# EAGLE schematic cc2650_rev1-2 (EAGLE 8.3.2)

## Sheet 1 of 2
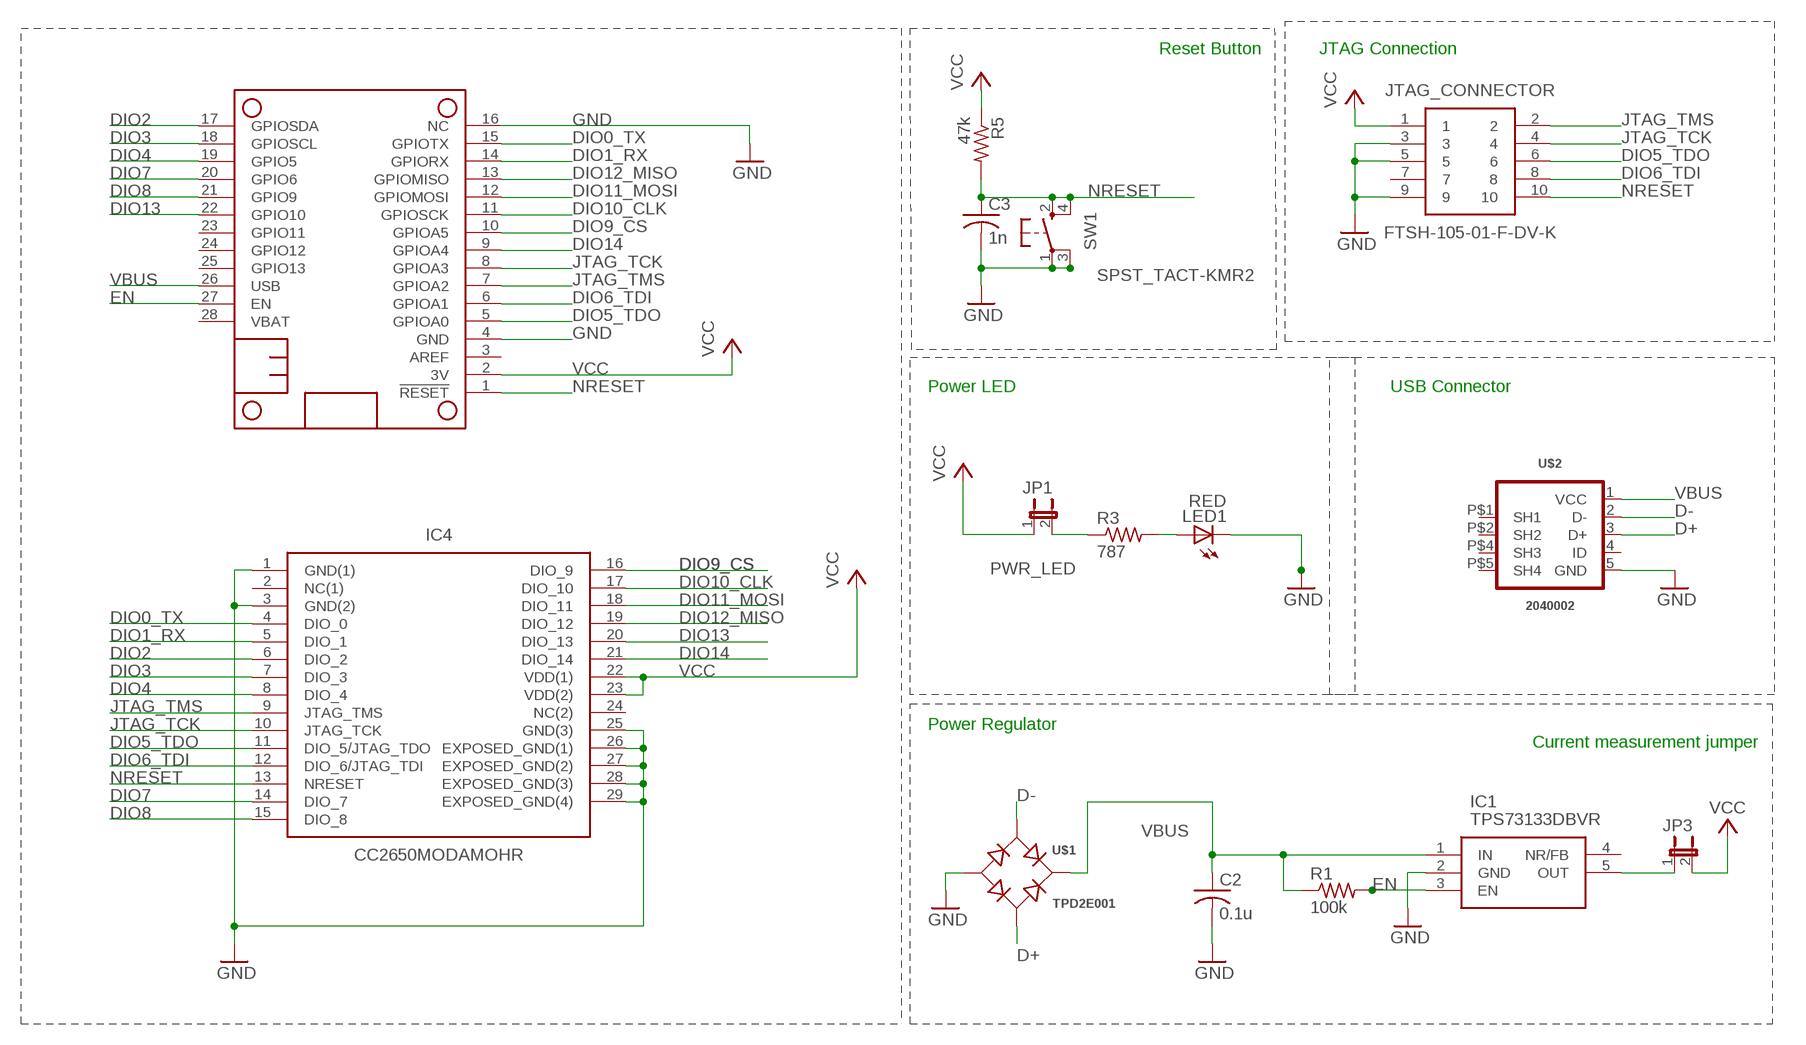
[diagram p0: schematic, sheet 1]

### Parts
C2  0.1u  C-USC1206  [C1206]
C3  1n  C-USC1206  [C1206]
IC1  TPS73133DBVR  [SOT95P280X145-5N]
IC4  CC2650MODAMOHR  [MOH0029A]
JP1  PWR_LED  JP1M  [JP1M]
JP3  PWR_LED  JP1M  [JP1M]
JTAG_CONNECTOR  FTSH-105-01-F-DV-K  [SAMTEC_FTSH-105-01-L-DV]
LED1  RED  LEDCHIPLED_1206  [CHIPLED_1206]
MS1  FEATHERWING_NODIM  [FEATHERWING_DIM]
R1  100k  R-US_R1206  [R1206]
R3  787  R-US_R1206  [R1206]
R5  47k  R-US_R1206  [R1206]
SW1  SPST_TACT-KMR2  [KMR2]
U$1  TPD2E001  [SOT-143]
U$2  2040002  [2040002]

### Nets
D+: U$1.3(AC2) U$2.3(D+)
D-: U$1.2(AC1) U$2.2(D-)
DIO0_TX: IC4.4(DIO_0) MS1.15(GPIOTX)
DIO1_RX: IC4.5(DIO_1) MS1.14(GPIORX)
DIO2: IC4.6(DIO_2) MS1.17(GPIOSDA)
DIO3: IC4.7(DIO_3) MS1.18(GPIOSCL)
DIO4: IC4.8(DIO_4) MS1.19(GPIO5)
DIO5_TDO: IC4.11(DIO_5/JTAG_TDO) JTAG_CONNECTOR.6 MS1.5(GPIOA0)
DIO6_TDI: IC4.12(DIO_6/JTAG_TDI) JTAG_CONNECTOR.8 MS1.6(GPIOA1)
DIO7: IC4.14(DIO_7) MS1.20(GPIO6)
DIO8: IC4.15(DIO_8) MS1.21(GPIO9)
DIO9_CS: IC4.16(DIO_9) MS1.10(GPIOA5)
DIO10_CLK: IC4.17(DIO_10) MS1.11(GPIOSCK)
DIO11_MOSI: IC4.18(DIO_11) MS1.12(GPIOMOSI)
DIO12_MISO: IC4.19(DIO_12) MS1.13(GPIOMISO)
DIO13: IC4.20(DIO_13) MS1.22(GPIO10) ; also sheet 2
DIO14: IC4.21(DIO_14) MS1.9(GPIOA4) ; also sheet 2
EN: IC1.3(EN) MS1.27(EN) R1.2
GND: C2.2 C3.2 IC1.2(GND) IC4.1(GND(1)) IC4.3(GND(2)) IC4.25(GND(3)) IC4.26(EXPOSED_GND(1)) IC4.27(EXPOSED_GND(2)) IC4.28(EXPOSED_GND(3)) IC4.29(EXPOSED_GND(4)) JTAG_CONNECTOR.3 JTAG_CONNECTOR.5 JTAG_CONNECTOR.9 LED1.C MS1.4(GND) MS1.16(NC) SW1.1(P) SW1.3(P1) U$1.1(-) U$2.5(GND) ; also sheet 2
JTAG_TCK: IC4.10(JTAG_TCK) JTAG_CONNECTOR.4 MS1.8(GPIOA3)
JTAG_TMS: IC4.9(JTAG_TMS) JTAG_CONNECTOR.2 MS1.7(GPIOA2)
NRESET: C3.1 IC4.13(NRESET) JTAG_CONNECTOR.10 MS1.1(!RESET) R5.2 SW1.2(S) SW1.4(S1)
PWR_LED: LED1.A R3.2
PWR_LED_JPR: JP1.2 R3.1
VBUS [Power]: C2.1 IC1.1(IN) MS1.26(USB) R1.1 U$1.4(+) U$2.1(VCC)
VCC: IC4.22(VDD(1)) IC4.23(VDD(2)) JP1.1 JP3.2 JTAG_CONNECTOR.1 MS1.2(3V) R5.1
VCC_JPR: IC1.5(OUT) JP3.1
Unconnected: IC1.4(NR/FB) IC4.2(NC(1)) IC4.24(NC(2)) JTAG_CONNECTOR.7 MS1.3(AREF) MS1.23(GPIO11) MS1.24(GPIO12) MS1.25(GPIO13) MS1.28(VBAT) U$2.4(ID) U$2.P$1(SH1) U$2.P$2(SH2) U$2.P$4(SH3) U$2.P$5(SH4)

### Notes on the sheet
- Reset Button | JTAG Connection
- Power LED | USB Connector
- Power Regulator
- Current measurement jumper

## Sheet 2 of 2
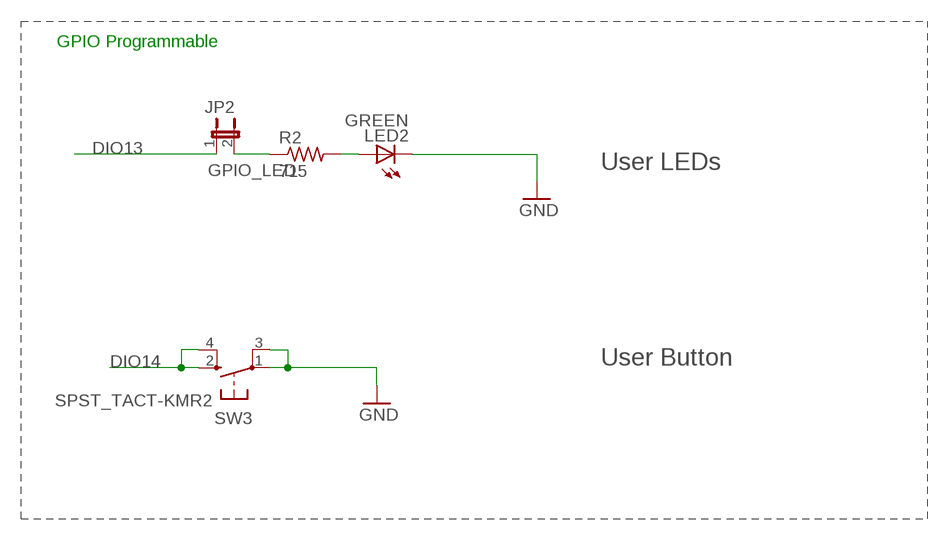
[diagram p1: schematic, sheet 2]

### Parts
JP2  GPIO_LED  JP1M  [JP1M]
LED2  GREEN  LEDCHIPLED_1206  [CHIPLED_1206]
R2  715  R-US_R1206  [R1206]
SW3  SPST_TACT-KMR2  [KMR2]

### Nets
DIO13: JP2.1 ; also sheet 1
DIO14: SW3.2(S) SW3.4(S1) ; also sheet 1
GND: LED2.C SW3.1(P) SW3.3(P1) ; also sheet 1
GPIO_LED: LED2.A R2.2
GPIO_LED_JPR: JP2.2 R2.1

### Notes on the sheet
- GPIO Programmable
- User LEDs
- User Button

## Library data of the parts
C2 C3 = adafruit:C-US: CAPACITOR, American symbol; MF: VISHAY/VITRAMON; MPN: VJ1206Y102KXBAC; OC_NEWARK: 48C2970
IC1 = TPS73133DBVR:TPS73133DBVR: Texas Instruments TPS73133DBVR, LDO Voltage Regulator, 0.15A, 3.3 V 0.5%, 1.7 5.5 Vin, 5-Pin SOT-23 Source: Datasheet <http://www.ti.com/lit/gpn/tps731>; DESCRIPTION: Texas Instruments TPS73133DBVR, LDO Voltage Regulator, 0.15A, 3.3 V 0.5%, 1.7 5.5 Vin, 5-Pin SOT-23; HEIGHT: 1.45mm; MANUFACTURER_NAME: Texas Instruments; MANUFACTURER_PART_NUMBER: TPS73133DBVR; MPN: TPS73133DBVR; OC_NEWARK: 86W6350; RS_PART_NUMBER: 6613970; SUPPLIER_NAME: RS
IC4 = CC2650MODAMOHR(2):CC2650MODAMOHR: SimpleLink Bluetooth low energy Wireless MCU Module <https://componentsearchengine.com/Images/9/CC2650MODAMOHR.jpg> Source: Datasheet <http://www.ti.com/lit/gpn/cc2650moda>; DESCRIPTION: SimpleLink Bluetooth low energy Wireless MCU Module; HEIGHT: mm; MANUFACTURER_NAME: Texas Instruments; MANUFACTURER_PART_NUMBER: CC2650MODAMOHR; MPN: CC2650MODAMOHR; OC_NEWARK: 02AC9626; SUPPLIER_NAME: RS
JP1-JP3 = jumper:JP1M; MPN: 2211S-02G; OC_NEWARK: 08N6744
JTAG_CONNECTOR = FTSH-105-01-F-DV-K:FTSH-105-01-F-DV-K: .050 x .050 CL DOUBLE VERTICAL SMT TERMINAL STRIP <https://componentsearchengine.com/Images/9/FTSH-105-01-F-DV-K.jpg> Source: Datasheet <http://suddendocs.samtec.com/prints/ftsh-1xx-xx-xxx-dv-xxx-xxx-mkt.pdf>; DESCRIPTION: .050 x .050 CL DOUBLE VERTICAL SMT TERMINAL STRIP; HEIGHT: mm; MANUFACTURER_NAME: SAMTEC; MANUFACTURER_PART_NUMBER: FTSH-105-01-F-DV-K; MPN: FTSH-105-01-F-DV-K; OC_NEWARK: 45P5160; SUPPLIER_NAME: RS
LED1 LED2 = adafruit:LED: LED OSRAM: - CHIPLED LG R971, LG N971, LY N971, LG Q971, LY Q971, LO R971, LY R971 LH N974, LH R974 LS Q976, LO Q976, LY Q976 LO Q996 - Hyper CHIPLED LW Q18S LB Q993, LB Q99A, LB R99A - SideLED LS A670, LO A670, LY A670, LG A670, LP A670 LB A673, LV A673, LT A673, LW A673 LH A674 LY A675 LS A676, LA A676, LO A676, LY A676, LW A676 LS A679, LY A679, LG A679 - Hyper Micro SIDELED® LS Y876, LA Y876, LO Y876, LY Y876 LT Y87S - SmartLED LW L88C, LW L88S LB L89C, LB L89S, LG L890 LS L89K, LO L89K, LY L89K LS L896, LA L896, LO L896, LY L896 - TOPLED LS T670, LO T670, LY T670, LG T670, LP T670 LSG T670, LSP T670, LSY T670, LOP T670, LYG T670 LG T671, LOG T671, LSG T671 LB T673, LV T673, LT T673, LW T673 LH T674 LS T676, LA T676, LO T676, LY T676, LB T676, LH T676, LSB T676, LW T676 LB T67C, LV T67C, LT T67C, LS T67K, LO T67K, LY T67K, LW E67C LS E67B, LA E67B, LO E67B, LY E67B, LB E67C, LV E67C, LT E67C LW T67C LS T679, LY T679, LG T679 LS T770, LO T770, LY T770, LG T770, LP T770 LB T773, LV T773, LT T773, LW T773 LH T774 LS E675, LA E675, LY E675, LS T675 LS T776, LA T776, LO T776, LY T776, LB T776 LHGB T686 LT T68C, LB T68C - Hyper Mini TOPLED® LB M676 - Mini TOPLED Santana® LG M470 LS M47K, LO M47K, LY M47K Source: http://www.osram.convergy.de/; MPN: HSMC-C150; OC_NEWARK: 05M0343
MS1 = wing_modified:FEATHERWING
R1-R3 = adafruit:R-US_: RESISTOR, American symbol; MPN: CR1206-FX-4700ELF; OC_NEWARK: 06X5194
R5 = adafruit:R-US_: RESISTOR, American symbol; MF: VISHAY/DALE; MPN: CRCW120647K0FKTA; OC_NEWARK: 32C8848
SW1 SW3 = adafruit:SPST_TACT: SMT 6mm switch, EVQQ2 series http://www.ladyada.net/library/eagle; MPN: KMR241G LFS; OC_NEWARK: 58M7854
U$1 = AMP_Ruler-LT1370:TPD2E001
U$2 = AMP_Ruler-LT1370:2040002

## Net classes
0 Default: width 0.203 mm, drill 0.305 mm, clearance 0.152 mm
1 Ground: width 0.203 mm, drill 0.305 mm, clearance 0.152 mm to class 0, clearance 0.152 mm
2 Power: width 0.203 mm, drill 0.305 mm, clearance 0.152 mm to class 0, clearance 0.152 mm to class 1, clearance 0.152 mm